# EAGLE design chuckwagon (EAGLE 6.4)
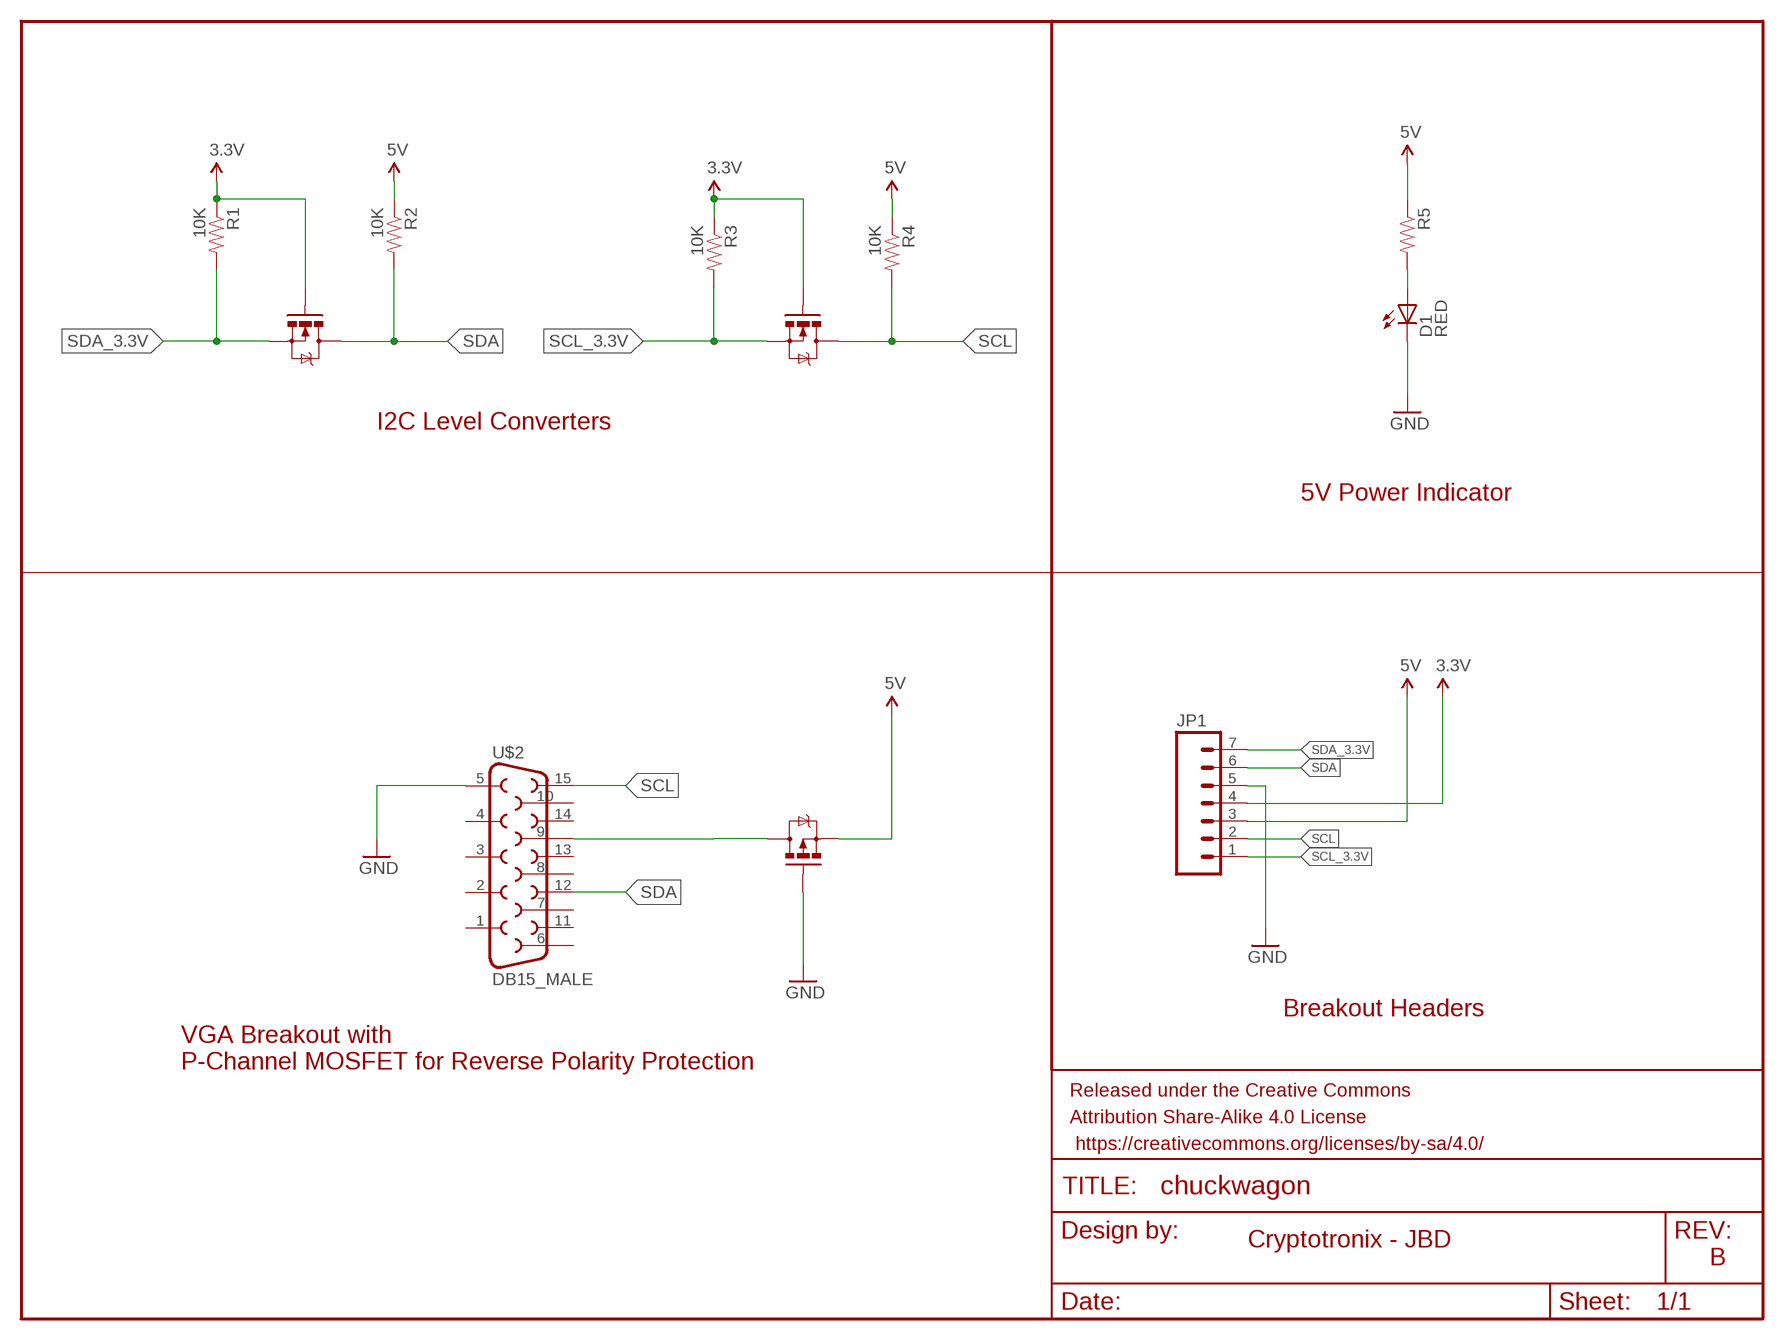
[diagram p0: schematic, sheet 1]

## Parts
D1  RED  LED-RED0603  [LED-0603]
FRAME1  FRAME-LETTER  [CREATIVE_COMMONS]
JP1  M07  [1X07]
Q1  MOSFET-NCHANNELBSS123LT1G  [SOT23]
Q2  MOSFET-NCHANNELBSS123LT1G  [SOT23]
Q3  MOSFET-PCHANNEL  [SOT23-3]
R1  10K  RESISTOR0603-RES  [0603-RES]
R2  10K  RESISTOR0603-RES  [0603-RES]
R3  10K  RESISTOR0603-RES  [0603-RES]
R4  10K  RESISTOR0603-RES  [0603-RES]
R5  RESISTOR0603-RES  [0603-RES]
U$2  DB15_MALE  [DB15_MALE]

## Nets
3.3V: JP1.4 Q1.1(G) Q2.1(G) R1.1 R3.1
5V: JP1.3 Q3.2(S) R2.1 R4.1 R5.1
GND: D1.C JP1.5 Q3.1(G) U$2.5
N$1: D1.A R5.2
N$2: Q3.3(D) U$2.9
SCL: JP1.2 Q2.3(D) R4.2 U$2.15
SCL_3.3V: JP1.1 Q2.2(S) R3.2
SDA: JP1.6 Q1.3(D) R2.2 U$2.12
SDA_3.3V: JP1.7 Q1.2(S) R1.2
Unconnected: U$2.1 U$2.2 U$2.3 U$2.4 U$2.6 U$2.7 U$2.8 U$2.10 U$2.11 U$2.13 U$2.14

## Notes on the sheet
- I2C Level Converters
- 5V Power Indicator
- Breakout Headers
- VGA Breakout with 
  P-Channel MOSFET for Reverse Polarity Protection
- Cryptotronix - JBD
- B

## Library data of the parts
D1 = SparkFun-LED:LED-RED: Assorted Red LEDs LilyPad 1206- DIO-09912 1206- DIO-00809 0603- DIO-00819; PROD_ID: DIO-00819
FRAME1 = SparkFun-Aesthetics:FRAME-LETTER: Schematic Frame Standard 8.5x11 US Letter frame
JP1 = SparkFun-Connectors:M07: Header 7 Standard 7-pin 0.1" header. Use with straight break away headers (SKU : PRT-00116), right angle break away headers (PRT-00553), swiss pins (PRT-00743), machine pins (PRT-00117), and female headers (PRT-00115). NOTES ON THE VARIANTS LOCK and LOCK_LONGPADS... This footprint was designed to help hold the alignment of a through-hole component (i.e. 7-pin header) while soldering it into place. You may notice that each hole has been shifted either up or down by 0.005 of an inch from it's more standard position (which is usually a perfectly straight line). This slight alteration caused the pins (the squares in the middle) to touch the edges of the holes. Because they are alternating, it causes a "brace" to hold the header in place. 0.005 has proven to be the perfect amount of "off-center" position when using our standard breakaway headers. Although looks a little odd when you look at the bare footprint, once you have a header in there, the alteration is very hard to notice. Also, if you push a header all the way into place, it is covered up entirely on the bottom side. This idea of altering the position of holes to aid alignment will be further integrated into the Sparkfun Library for other footprints. It can help hold any component with 3 or more connection pins.
Q1 Q2 = SparkFun-DiscreteSemi:MOSFET-NCHANNEL: Common NMOSFET Parts MFG P/N Store ID Prod ID FDD8780 TRANS-09984 SI7820DN TRANS-11055 FDS6630A IC-08089 2N7002PW TRANS-11151 FQP30N06L COM-10213 TRANS-10060 BSS123LT1G TRANS-08345 BSS138 TRANS-00830 BS170 2N7000; PROD_ID: TRANS-08345
Q3 = SparkFun-DiscreteSemi:MOSFET-PCHANNEL: Generic PMOSFET IRLML2244 - TRANS-11153 (SOT-23 -20V -4.3A) (1.Gate 2.Source 3.Drain) FQP27P06 - COM-10349 <http://www.sparkfun.com/products/10349> (TO-220 -60V -27A) (1.Gate 2.Source 3.Drain); PROD_ID: TRANS-08285
R1-R5 = SparkFun-Passives:RESISTOR: Resistor Basic schematic elements and footprints for 0603, 1206, and PTH resistors.
U$2 = SparkFun-Connectors:DB15_MALE: VGA DB_15 Right Angle connector

## Board
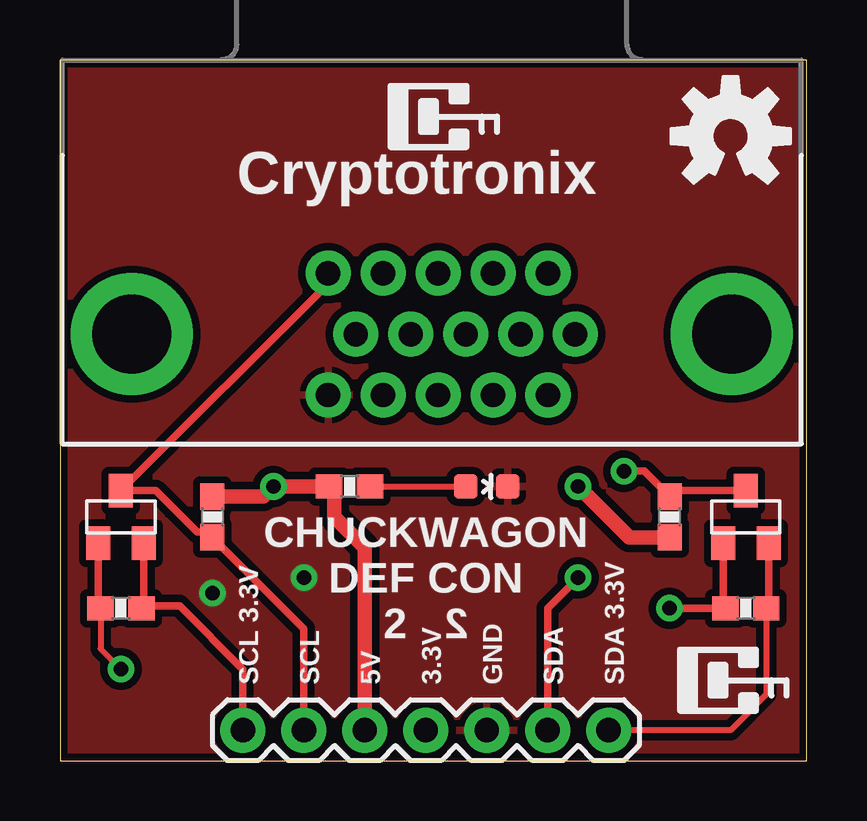
[diagram p1: board, top side]
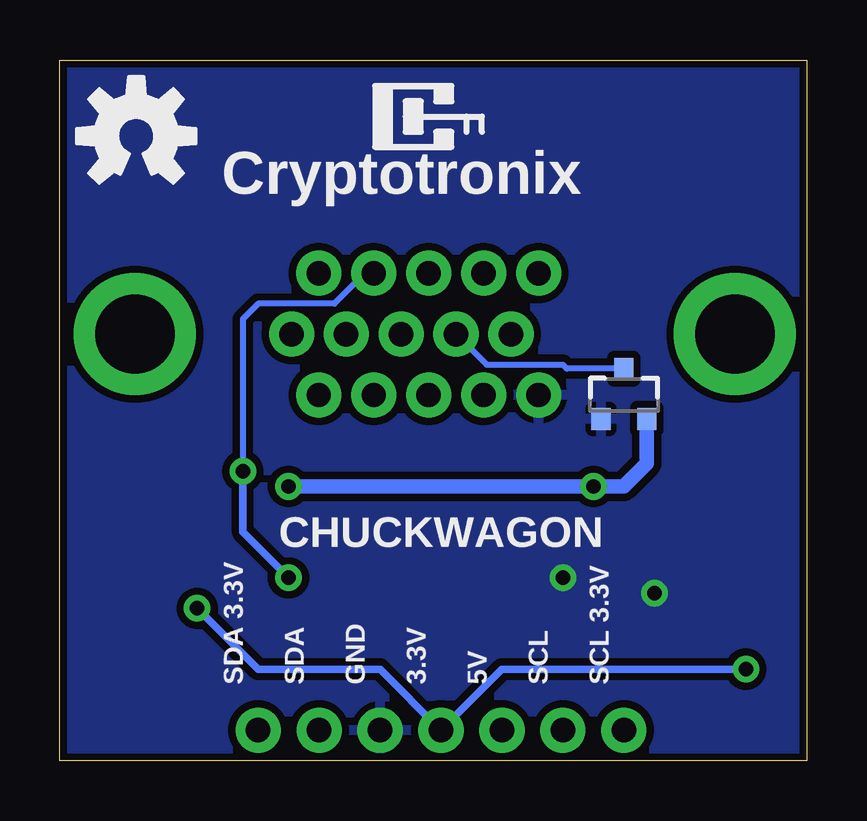
[diagram p2: board, bottom side, seen from below]

Size 31.11 x 29.21 mm. Coordinates in mm from the lower left corner, seen from the top.
Outline: 0,0 31.11,0 31.11,29.21 0,29.2 0,0
Copper layers (1*16): Top 0.035mm / dielectric 1.5mm / Bottom 0.035mm
Design rules "SparkFun": minimum track width 8mil, minimum drill 20mil, track to track 8mil, track to pad 8mil, pad to pad 8mil, via to via 8mil, smd to smd 8mil, copper to edge 10mil, drill to drill 8mil, minimum pad ring 12mil, minimum via ring 10mil, stop-mask expansion 4mil, vias tented up to drill 25mil, thermal gap 10mil

### Footprints (pad centres in the part's own frame; a part is rotated, then mirrored left to right if it is on the bottom)
LED-0603 = smd 1 x 1: A 0,-0.877; C 0,0.877
1X07 = drill 1.016 pad 1.88: 1 0,0; 2 2.54,0; 3 5.08,0; 4 7.62,0; 5 10.16,0; 6 12.7,0; 7 15.24,0
SOT23 = smd 1 x 1.4: 1 -0.95,-1.1; 2 0.95,-1.1; 3 0,1.1
SOT23-3 = smd 0.8 x 0.9: 1 -0.95,-1; 2 0.95,-1; 3 0,1.1
0603-RES = smd 1.1 x 1: 1 -0.85,0; 2 0.85,0
DB15_MALE = drill 1.016 pad 1.88: 1 4.84,-10.16; 2 2.55,-10.16; 3 0.26,-10.16; 4 -2.03,-10.16; 5 -4.32,-10.16; 6 5.97,-7.62; 7 3.7,-7.62; 8 1.41,-7.62; 9 -0.88,-7.62; 10 -3.17,-7.62; 11 4.84,-5.08; 12 2.55,-5.08; 13 0.26,-5.08; 14 -2.03,-5.08; 15 -4.32,-5.08 | drill 3.302 pad 5.08: G1 -12.5,-7.62; G2 12.5,-7.62

### Placement (x,y rotation side)
D1  17.78,11.43 270 top
FRAME1  1.27,-15.24 0 top  (outside the outline)
JP1  7.62,1.27 0 top
Q1  28.57,10.16 0 top
Q2  2.54,10.16 0 top
Q3  7.62,15.24 0 bottom
R1  28.57,6.35 0 top
R2  25.4,10.16 90 top
R3  2.54,6.35 0 top
R4  6.35,10.16 270 top
R5  12.06,11.43 0 top
U$1  [OSHW-LOGO-M]  27.94,26.04 0 top
U$2  15.49,25.4 0 top
U$3  [OSHW-LOGO-M]  27.94,26.04 0 bottom

### Tracks (layer width: path | path; a pad name or v marks a point on that pad's centre or on a via)
3.3V  (via drill 0.6, 0.6 pad 0.61)
  Top 0.254: R3.1 1.69,4.66 v2.54,3.81
  Top 0.305: Q2.1 1.59,6.45 R3.1 | v25.4,6.35 R1.1 27.62,6.45 Q1.1
  Bottom 0.305: v2.54,3.81 12.7,3.81 JP1.4 17.78,3.81 22.86,3.81 v25.4,6.35
5V  (via drill 0.6, 0.6 pad 0.61)
  Top 0.254: 11.43,11.21 R5.1
  Top 0.61: R5.1 v8.89,11.43 8.47,11.01 R4.1 | R2.1 23.71,9.31 v21.59,11.43 | 11.43,11.21 11.43,10.16 12.7,8.89 JP1.3
  Bottom 0.61: Q3.2 6.67,12.38 7.62,11.43 v8.89,11.43 v21.59,11.43
GND  (via drill 0.6 pad 0.61)
  other vias: 6.35,6.98 10.16,7.62
  pour Bottom (isolate 0.305): 0,-3.81 0,34.29 31.75,34.29 31.75,-3.81
  pour Top (isolate 0.305): 0,34.29 0,-3.81 31.75,-3.81 31.75,34.92
N$1
  Top 0.254: R5.2 D1.A
N$2
  Bottom 0.254: U$2.9 13.34,16.51 10.16,16.51 9.99,16.34 Q3.3
SCL
  Top 0.305: U$2.15 11.17,19.89 Q2.3 3.98,11.26 5.71,9.53 6.13,9.53 R4.2 10.16,5.5 JP1.2
SCL_3.3V
  Top 0.305: Q2.2 3.49,6.45 | JP1.1 7.62,3.81 4.98,6.45 3.49,6.45 | 3.49,6.45 R3.2
SDA  (via drill 0.6 pad 0.61)
  Top 0.305: Q1.3 25.65,11.26 R2.2 24.34,12.06 v23.5,12.06 | JP1.6 20.32,6.35 v21.59,7.62
  Bottom 0.254: U$2.12 18.41,20.32 19.68,19.05 22.86,19.05 23.5,18.42 v23.5,12.06
  Bottom 0.305: v21.59,7.62 23.5,9.53 v23.5,12.06
SDA_3.3V
  Top 0.254: R1.2 29.43,2.76 27.94,1.27 JP1.7
  Top 0.305: Q1.2 29.52,6.45 R1.2

### Text on the board
tPlace: Cryptotronix | CHUCKWAGON | DEF CON | 2 | 2 | SCL 3.3V | SCL | 5V | 3.3V | GND | SDA | SDA | SDA 3.3V
bPlace: Cryptotronix | CHUCKWAGON | SCL 3.3V | SCL | 5V | 3.3V | GND | SDA | SDA 3.3V